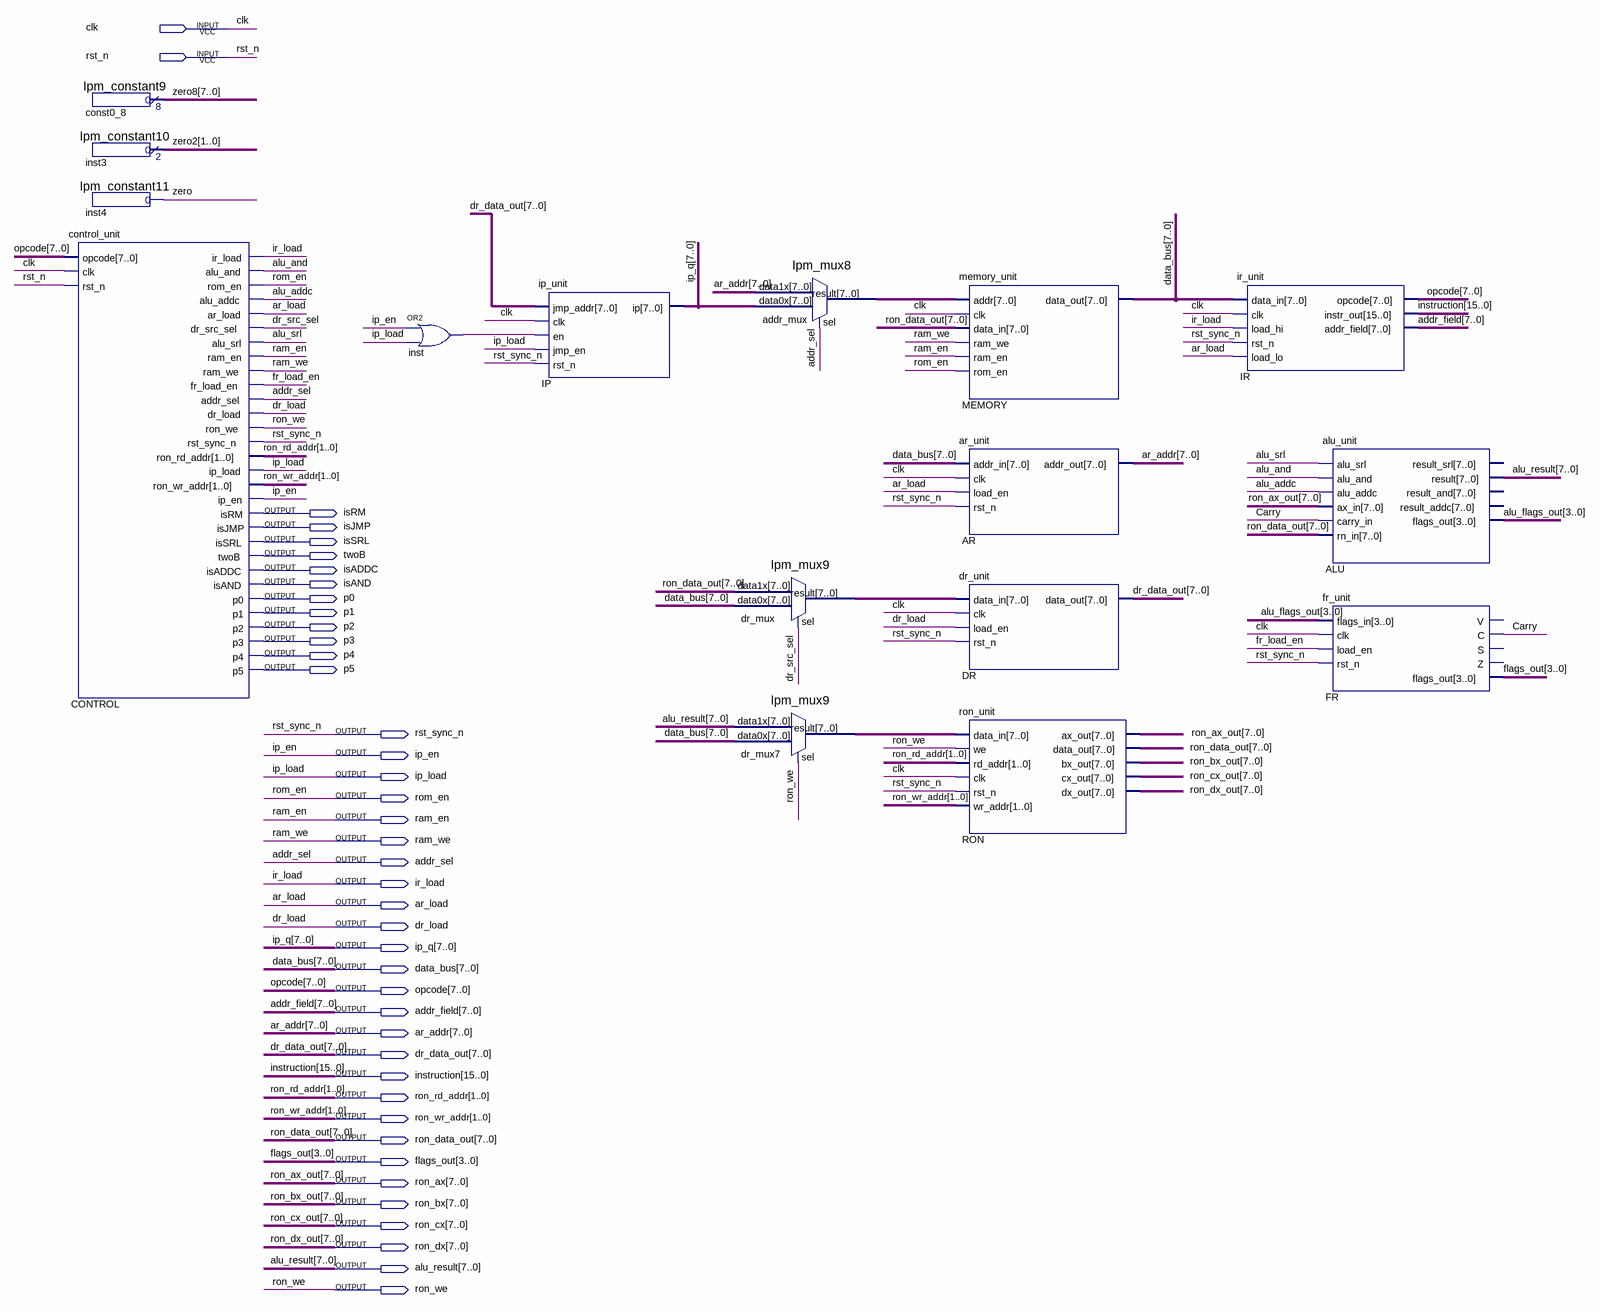
[diagram p0: schematic sheet]
// Quartus schematic chain-tests.bdf as structural Verilog: 16 symbols, 41 pins
module \chain-tests  (
  input  clk,
  input  rst_n,
  output isRM,
  output isJMP,
  output isSRL,
  output twoB,
  output isADDC,
  output isAND,
  output p0,
  output p1,
  output p2,
  output p3,
  output p4,
  output p5,
  output rst_sync_n,
  output ip_en,
  output ip_load,
  output rom_en,
  output ram_en,
  output ram_we,
  output addr_sel,
  output ir_load,
  output ar_load,
  output dr_load,
  output [7:0] ip_q,
  output [7:0] data_bus,
  output [7:0] opcode,
  output [7:0] addr_field,
  output [7:0] ar_addr,
  output [7:0] dr_data_out,
  output [15:0] instruction,
  output [1:0] ron_rd_addr,
  output [1:0] ron_wr_addr,
  output [7:0] ron_data_out,
  output [3:0] flags_out,
  output [7:0] ron_ax,
  output [7:0] ron_bx,
  output [7:0] ron_cx,
  output [7:0] ron_dx,
  output [7:0] alu_result,
  output ron_we
);

  wire alu_addc, alu_and, alu_srl, Carry, dr_src_sel, fr_load_en, inst_out, zero;
  wire [1:0] zero2;
  wire [3:0] alu_flags_out;
  wire [7:0] addr_mux_result, dr_mux7_result, dr_mux_result, zero8;

  lpm_constant9 const0_8 (.result(zero8));
  lpm_constant10 inst3 (.result(zero2));
  lpm_constant11 inst4 (.result(zero));
  control_unit CONTROL (
    .opcode(opcode), .clk(clk), .rst_n(rst_n), .ir_load(ir_load), .alu_and(alu_and), .rom_en(rom_en),
    .alu_addc(alu_addc), .ar_load(ar_load), .dr_src_sel(dr_src_sel), .alu_srl(alu_srl), .ram_en(ram_en),
    .ram_we(ram_we), .fr_load_en(fr_load_en), .addr_sel(addr_sel), .dr_load(dr_load), .ron_we(ron_we),
    .rst_sync_n(rst_sync_n), .ron_rd_addr(ron_rd_addr), .ip_load(ip_load), .ron_wr_addr(ron_wr_addr),
    .ip_en(ip_en), .isRM(isRM), .isJMP(isJMP), .isSRL(isSRL), .twoB(twoB), .isADDC(isADDC), .isAND(isAND),
    .p0(p0), .p1(p1), .p2(p2), .p3(p3), .p4(p4), .p5(p5));
  or inst (inst_out, ip_en, ip_load);
  ip_unit IP (.jmp_addr(dr_data_out), .clk(clk), .en(inst_out), .jmp_en(ip_load), .rst_n(rst_sync_n), .ip(ip_q));
  lpm_mux9 dr_mux (.data1x(ron_data_out), .data0x(data_bus), .sel(dr_src_sel), .result(dr_mux_result));
  lpm_mux9 dr_mux7 (.data1x(alu_result), .data0x(data_bus), .sel(ron_we), .result(dr_mux7_result));
  lpm_mux8 addr_mux (.data1x(ar_addr), .data0x(ip_q), .sel(addr_sel), .result(addr_mux_result));
  memory_unit MEMORY (
    .addr(addr_mux_result), .clk(clk), .data_in(ron_data_out), .ram_we(ram_we), .ram_en(ram_en),
    .rom_en(rom_en), .data_out(data_bus));
  ar_unit AR (.addr_in(data_bus), .clk(clk), .load_en(ar_load), .rst_n(rst_sync_n), .addr_out(ar_addr));
  dr_unit DR (.data_in(dr_mux_result), .clk(clk), .load_en(dr_load), .rst_n(rst_sync_n), .data_out(dr_data_out));
  ron_unit RON (
    .data_in(dr_mux7_result), .we(ron_we), .rd_addr(ron_rd_addr), .clk(clk), .rst_n(rst_sync_n),
    .wr_addr(ron_wr_addr), .ax_out(ron_ax), .data_out(ron_data_out), .bx_out(ron_bx), .cx_out(ron_cx),
    .dx_out(ron_dx));
  ir_unit IR (
    .data_in(data_bus), .clk(clk), .load_hi(ir_load), .rst_n(rst_sync_n), .load_lo(ar_load), .opcode(opcode),
    .instr_out(instruction), .addr_field(addr_field));
  alu_unit ALU (
    .alu_srl(alu_srl), .alu_and(alu_and), .alu_addc(alu_addc), .ax_in(ron_ax), .carry_in(Carry),
    .rn_in(ron_data_out), .result(alu_result), .flags_out(alu_flags_out));  // open: result_srl, result_and, result_addc
  fr_unit FR (
    .flags_in(alu_flags_out), .clk(clk), .load_en(fr_load_en), .rst_n(rst_sync_n), .C(Carry),
    .flags_out(flags_out));  // open: V, S, Z

  // Other names for the same wires on the sheet: ron_ax_out[7:0] = ron_ax; ron_bx_out[7:0] = ron_bx;
  //   ron_cx_out[7:0] = ron_cx; ron_dx_out[7:0] = ron_dx
endmodule
